# Altium schematic sheet charge_pump.SchDoc: Charge Pump
size A; Engineer: A. Peck; Organization: UCLA High Energy Physics; DocumentNumber: 15; Revision: 3.0; SheetNumber: 15; SheetTotal: 15; Project: LCT Comparator Tester; ProjectName: LCT Comparator Tester
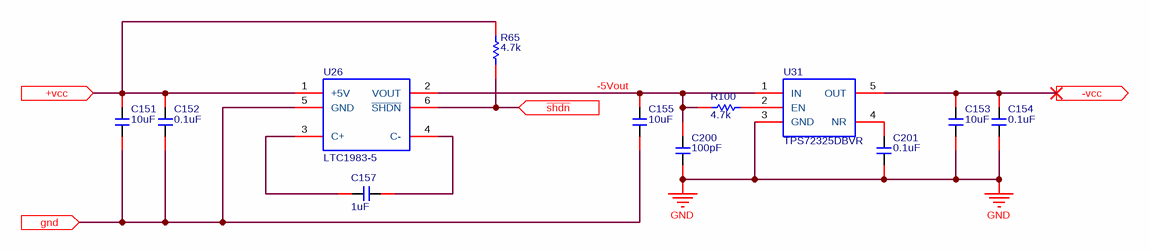
[diagram p0: charge_pump.SchDoc]

## Parts
C151  10uF  [c1206]
C152  0.1uF  [C0603]
C153  10uF  [c1206]
C154  0.1uF  [C0603]
C155  10uF  [c1206]
C157  1uF  [C0603]
C200  100pF  [C0603]
C201  0.1uF  [C0603]
R65  4.7k  [R0603]
R100  4.7k  [R0603]
U26  LTC1983-5  [sot23-6]
U31  TPS72325DBVR  [SOT23-5]

## Ports
+vcc (in), -vcc (out), gnd (in), ~{shdn} (in)

## Nets
GND: C153.1 C154.1 C200.1 C201.1 U31.3(GND)
+vcc: C151.2 C152.2 R65.2 U26.1(+5V) ; port +vcc
-5Vout: C155.1 C200.2 R100.2 U26.2(VOUT) U31.1(IN)
-vcc: C153.2 C154.2 U31.5(OUT) ; port -vcc
gnd: C151.1 C152.1 C155.2 U26.5(GND) ; port gnd  [a separate net that carries the same name]
~{shdn}: R65.1 U26.6(~{SHDN}) ; port ~{shdn}
NetC157_1: C157.1 U26.3(C+)
NetC157_2: C157.2 U26.4(C-)
NetC201_2: C201.2 U31.4(NR)
NetR100_1: R100.1 U31.2(EN)

## Notes on the sheet
- Date:
- Rev:
- of
- Sheet

## Library data of the parts
C151 C153 C155 = CAP/GMK316F106ZL-T: CAP-CER, 2, 10uF, 10%, 35V, 1206; Manufacturer: Taiyo Yuden; Capacitance: 10µF; Tolerance: -20%, +80%; Temperature Coefficient: Y5V (F); Supplier 1: Digi-Key; Supplier Part Number 1: 587-1352-1-ND; Manufacturer Part Number: GMK316F106ZL-T; RoHS: RoHS Compliant; Category: Capacitors; Stock 1: 249989; Pricing 1: 1=0.46, 10=0.345, 50=0.2012, 100=0.161, 250=0.115, 500=0.0782, 1000=0.06325 (USD); Packaging: Cut Tape (CT); Voltage - Rated: 35V; Mounting Type: Surface Mount, MLCC; Operating Temperature: -30°C ~ 85°C; Applications: General Purpose; Ratings: -; Package / Case: 1206 (3216 Metric); Size / Dimension: 0.126" L x 0.063" W (3.20mm x 1.60mm); Height - Seated (Max): -; Thickness (Max): 0.071" (1.80mm); Lead Spacing: -; Features: -; Lead Style: -; ComponentLink1URL: http://ds.yuden.co.jp/TYCOMPAS/ut/detail.do?productNo=GMK316F106ZL-T&fileName=GMK316F106ZL-T_SS&mode=specSheetDownload; ComponentLink1Description: http://ds.yuden.co.jp/TYCOMPAS/ut/detail.do?productNo=GMK316F106ZL-T&fileName=GMK316F106ZL-T_SS&mode=specSheetDownload
C152 C154 C201 = CAP/06035C104KAT2A: CAP-CER, 2, 0.1uF, 10%, 50V, 0603, X7R; Manufacturer: AVX Corporation; Capacitance: 0.10µF; Supplier 1: Digi-Key; Supplier Part Number 1: 478-5052-1-ND; Manufacturer Part Number: 06035C104KAT2A; RoHS: RoHS Compliant; Category: Capacitors; Stock 1: 4412408; Pricing 1: 1=0.1, 10=0.036, 25=0.0264, 50=0.0198, 100=0.0162, 250=0.01352, 500=0.01156, 1000=0.00908 (USD); Packaging: Cut Tape (CT); Tolerance: ±10%; Voltage - Rated: 50V; Temperature Coefficient: X7R; Mounting Type: Surface Mount, MLCC; Operating Temperature: -55°C ~ 125°C; Applications: General Purpose; Ratings: -; Package / Case: 0603 (1608 Metric); Size / Dimension: 0.063" L x 0.032" W (1.60mm x 0.81mm); Height - Seated (Max): -; Thickness (Max): 0.035" (0.90mm); Lead Spacing: -; Features: -; Lead Style: -; ComponentLink1URL: http://datasheets.avx.com/X7RDielectric.pdf; ComponentLink1Description: http://datasheets.avx.com/X7RDielectric.pdf; Supplier 2: Newark; Supplier Part Number 2: 54K2412
C157 = Murata/GRM188R61E105KA12D: CAP-CER, 2, 1.0uF, 10%, 25V, 0603; Manufacturer: Murata Electronics North America; Capacitance: 1µF; Temperature Coefficient: X5R; Supplier 1: Digi-Key; Supplier Part Number 1: 490-3897-1-ND; Manufacturer Part Number: GRM188R61E105KA12D; RoHS: RoHS Compliant; Category: Capacitors; Stock 1: 1899119; Pricing 1: 1=0.1, 10=0.036, 50=0.0196, 100=0.0165, 250=0.01352, 500=0.01156, 1000=0.009 (USD); Packaging: Cut Tape (CT); Tolerance: ±10%; Voltage - Rated: 25V; Mounting Type: Surface Mount, MLCC; Operating Temperature: -55°C ~ 85°C; Applications: General Purpose; Ratings: -; Package / Case: 0603 (1608 Metric); Size / Dimension: 0.063" L x 0.031" W (1.60mm x 0.80mm); Height - Seated (Max): -; Thickness (Max): 0.035" (0.90mm); Lead Spacing: -; Features: -; Lead Style: -; ComponentLink1URL: http://www.murata.com/~/media/webrenewal/support/library/catalog/products/capacitor/mlcc/c02e.pdf; ComponentLink1Description: http://www.murata.com/~/media/webrenewal/support/library/catalog/products/capacitor/mlcc/c02e.pdf
C200 = AVX/06035A101KAT2A: CAP-CER, 0, 100pF, 10%, 50V, 0603; Manufacturer: AVX Corporation; Temperature Coefficient: C0G, NP0; Supplier 1: Digi-Key; Supplier Part Number 1: 478-3717-1-ND; Manufacturer Part Number: 06035A101KAT2A; RoHS: RoHS Compliant; Category: Capacitors; Stock 1: 55355; Pricing 1: 1=0.16, 10=0.117, 25=0.0856, 50=0.0664, 100=0.0551, 250=0.04556, 500=0.03862, 1000=0.03197 (USD); Packaging: Cut Tape (CT); Part Status: Active; Capacitance: 100pF; Tolerance: ±10%; Voltage - Rated: 50V; Operating Temperature: -55°C ~ 125°C; Features: -; Ratings: -; Applications: General Purpose; Failure Rate: *; Mounting Type: Surface Mount, MLCC; Package / Case: 0603 (1608 Metric); Size / Dimension: 0.063" L x 0.032" W (1.60mm x 0.81mm); Height - Seated (Max): -; Thickness (Max): 0.035" (0.90mm); Lead Spacing: -; Lead Style: -; ComponentLink1URL: http://catalogs.avx.com/SurfaceMount.pdf; ComponentLink1Description: http://catalogs.avx.com/SurfaceMount.pdf
R65 R100 = CRCW06034K70FKEA: RES1, SMD, 4.70k, 1.0%, 1/10W, 0603; Manufacturer: Vishay Dale; Tolerance: ±1%; Power (Watts): 0.1W, 1/10W; Temperature Coefficient: ±100ppm/°C; Supplier 1: Digi-Key; Manufacturer Part Number: CRCW06034K70FKEA; RoHS: RoHS Compliant; Category: Resistors; Stock 1: 413202; Pricing 1: 1=0.1, 10=0.03, 25=0.022, 50=0.0168, 100=0.0123, 250=0.0094, 500=0.00752, 1000=0.00554, 2500=0.00481 (USD); Packaging: Cut Tape (CT); Resistance (Ohms): 4.7k; Composition: Thick Film; Features: Automotive AEC-Q200; Operating Temperature: -55°C ~ 155°C; Package / Case: 0603 (1608 Metric); Supplier Device Package: 0603; Size / Dimension: 0.063" L x 0.033" W (1.60mm x 0.85mm); Number of Terminations: 2; ComponentLink1URL: http://www.vishay.com/docs/20035/dcrcwe3.pdf; ComponentLink1Description: http://www.vishay.com/docs/20035/dcrcwe3.pdf; Supplier Part Number 1: 541-4.70KHCT-ND; Part Status: Active; Height - Seated (Max): 0.020" (0.50mm); Failure Rate: -
U26 = LT/LTC1983-5: REG, Charge Pump, Inverting, 100mA, -5V; Manufacturer: Linear Technology; Manufacturer Part Number: LTC1983ES6-5#TRMPBF; Function: Step-Up/Step-Down; Output Configuration: Negative; Output Type: Fixed; Number of Outputs: 1; Voltage - Input (Min): 2.3V; Voltage - Input (Max): 5.5V; Frequency - Switching: 900kHz; Synchronous Rectifier: No; Supplier 1: Digi-Key; RoHS: RoHS Compliant; Category: Integrated Circuits (ICs); Stock 1: 13395; Pricing 1: 1=4.28, 25=3.8192, 100=3.4371 (USD); Packaging: Cut Tape (CT); Topology: Charge Pump; Voltage - Output (Min/Fixed): -5V; Voltage - Output (Max): -; Current - Output: 100mA; Operating Temperature: -40°C ~ 85°C (TA); Mounting Type: Surface Mount; Package / Case: SOT-23-6 Thin, TSOT-23-6; Supplier Device Package: TSOT-23-6; ComponentLink1URL: http://www.linear.com/docs/2135; ComponentLink1Description: http://www.linear.com/docs/2135; Supplier Part Number 1: LTC1983ES6-5#TRMPBFCT-ND
U31 = TPS72325DBVR: LDO, Neg -2.5V, 200mA; Manufacturer: Texas Instruments; Regulator Topology: Negative Fixed; Voltage - Dropout (Typical): 0.28V @ 200mA; Number of Regulators: 1; Voltage - Input: -2.7 V ~ -10 V; Current - Limit (Min): 300mA; Supplier 1: Digi-Key; Manufacturer Part Number: TPS72325DBVR; RoHS: RoHS Compliant; Category: Integrated Circuits (ICs); Stock 1: 2132; Pricing 1: 1=2.87, 10=2.58, 100=2.0696, 500=1.701, 1000=1.18125 (USD); Packaging: Cut Tape (CT); Part Status: Active; Voltage - Output: -2.5V; Current - Output: 200mA; Operating Temperature: -40°C ~ 125°C; Mounting Type: Surface Mount; Package / Case: SC-74A, SOT-753; Supplier Device Package: SOT-23-5; ComponentLink1URL: http://www.ti.com/lit/ds/symlink/tps723.pdf; ComponentLink1Description: http://www.ti.com/lit/ds/symlink/tps723.pdf; Supplier Part Number 1: 296-39479-1-ND